# Altium schematic sheet SIM-3031_SMN-303.schdoc.schdoc
size 127 x 99 mm
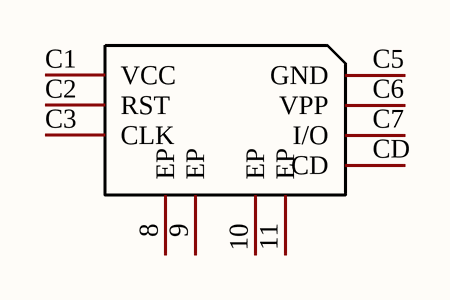
[diagram p0: SIM-3031_SMN-303.schdoc.schdoc]

## Parts
CARD?  SMN-303  [SIM-SMD_SMN-303]  (value not drawn)

## Nets

Not connected (* = marked no-connect by the designer): CARD? 8(EP) 9(EP) 10(EP) 11(EP) C1(VCC) C2(RST) C3(CLK) C5(GND) C6(VPP) C7(I/O) CD

## Library data of the parts
CARD? = SMN-303: Manufacturer: XUNPU(讯普); Add into BOM: yes; Card Connection Mode: 自弹式; Card Type: NanoSIM卡; Connector Type: 卡座; Body Height (Max): 1.37mm; Welding Temperature (Max): 260℃; Symbol: SMN-303; Device: SMN-303; Supplier: LCSC; Supplier Part: C266888; Manufacturer Part: SMN-303; JLCPCB Part Class: Extended Part; LCSC Part Name: 自弹式 NanoSIM卡 卡座; Supplier Footprint: SMD; Datasheet: https://atta.szlcsc.com/upload/public/pdf/source/20230608/69FA23A73293DEADC31E393DD83871F4.pdf; Convert to PCB: yes; Contact Material: C5191; Contact Plating: 金; Operating Temperature Range: -40℃~+85℃